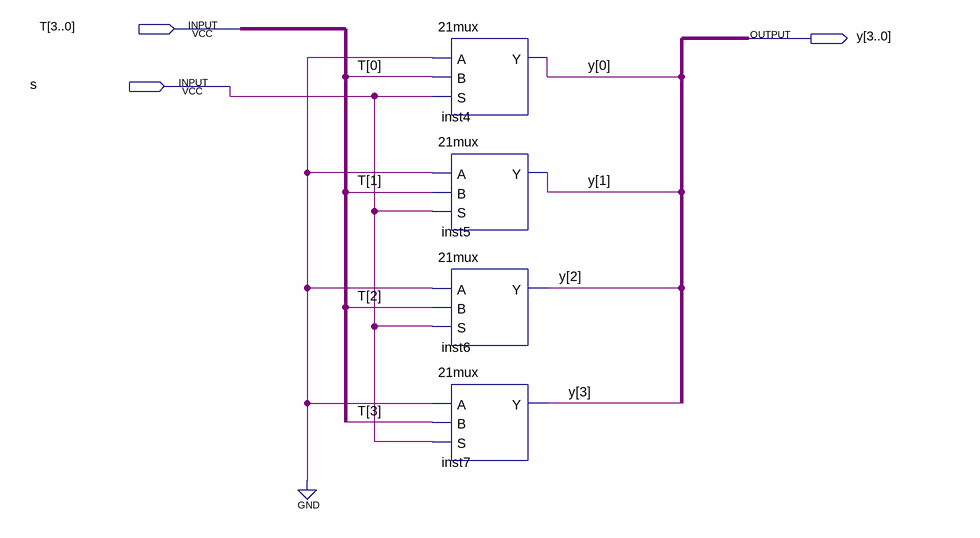
[diagram p0: schematic sheet]
// Quartus schematic Bus_Mux21.bdf as structural Verilog: 4 symbols, 3 pins
module Bus_Mux21 (
  input  [3:0] T,
  input  s,
  output [3:0] y
);

  \21mux  inst4 (.A(1'b0), .B(T[0]), .S(s), .Y(y[0]));
  \21mux  inst5 (.A(1'b0), .B(T[1]), .S(s), .Y(y[1]));
  \21mux  inst6 (.A(1'b0), .B(T[2]), .S(s), .Y(y[2]));
  \21mux  inst7 (.A(1'b0), .B(T[3]), .S(s), .Y(y[3]));
endmodule
